# Altium schematic sheet Microcontroleur.SchDoc
size 408 x 276 mm; SheetNumber: 2; SheetTotal: 3
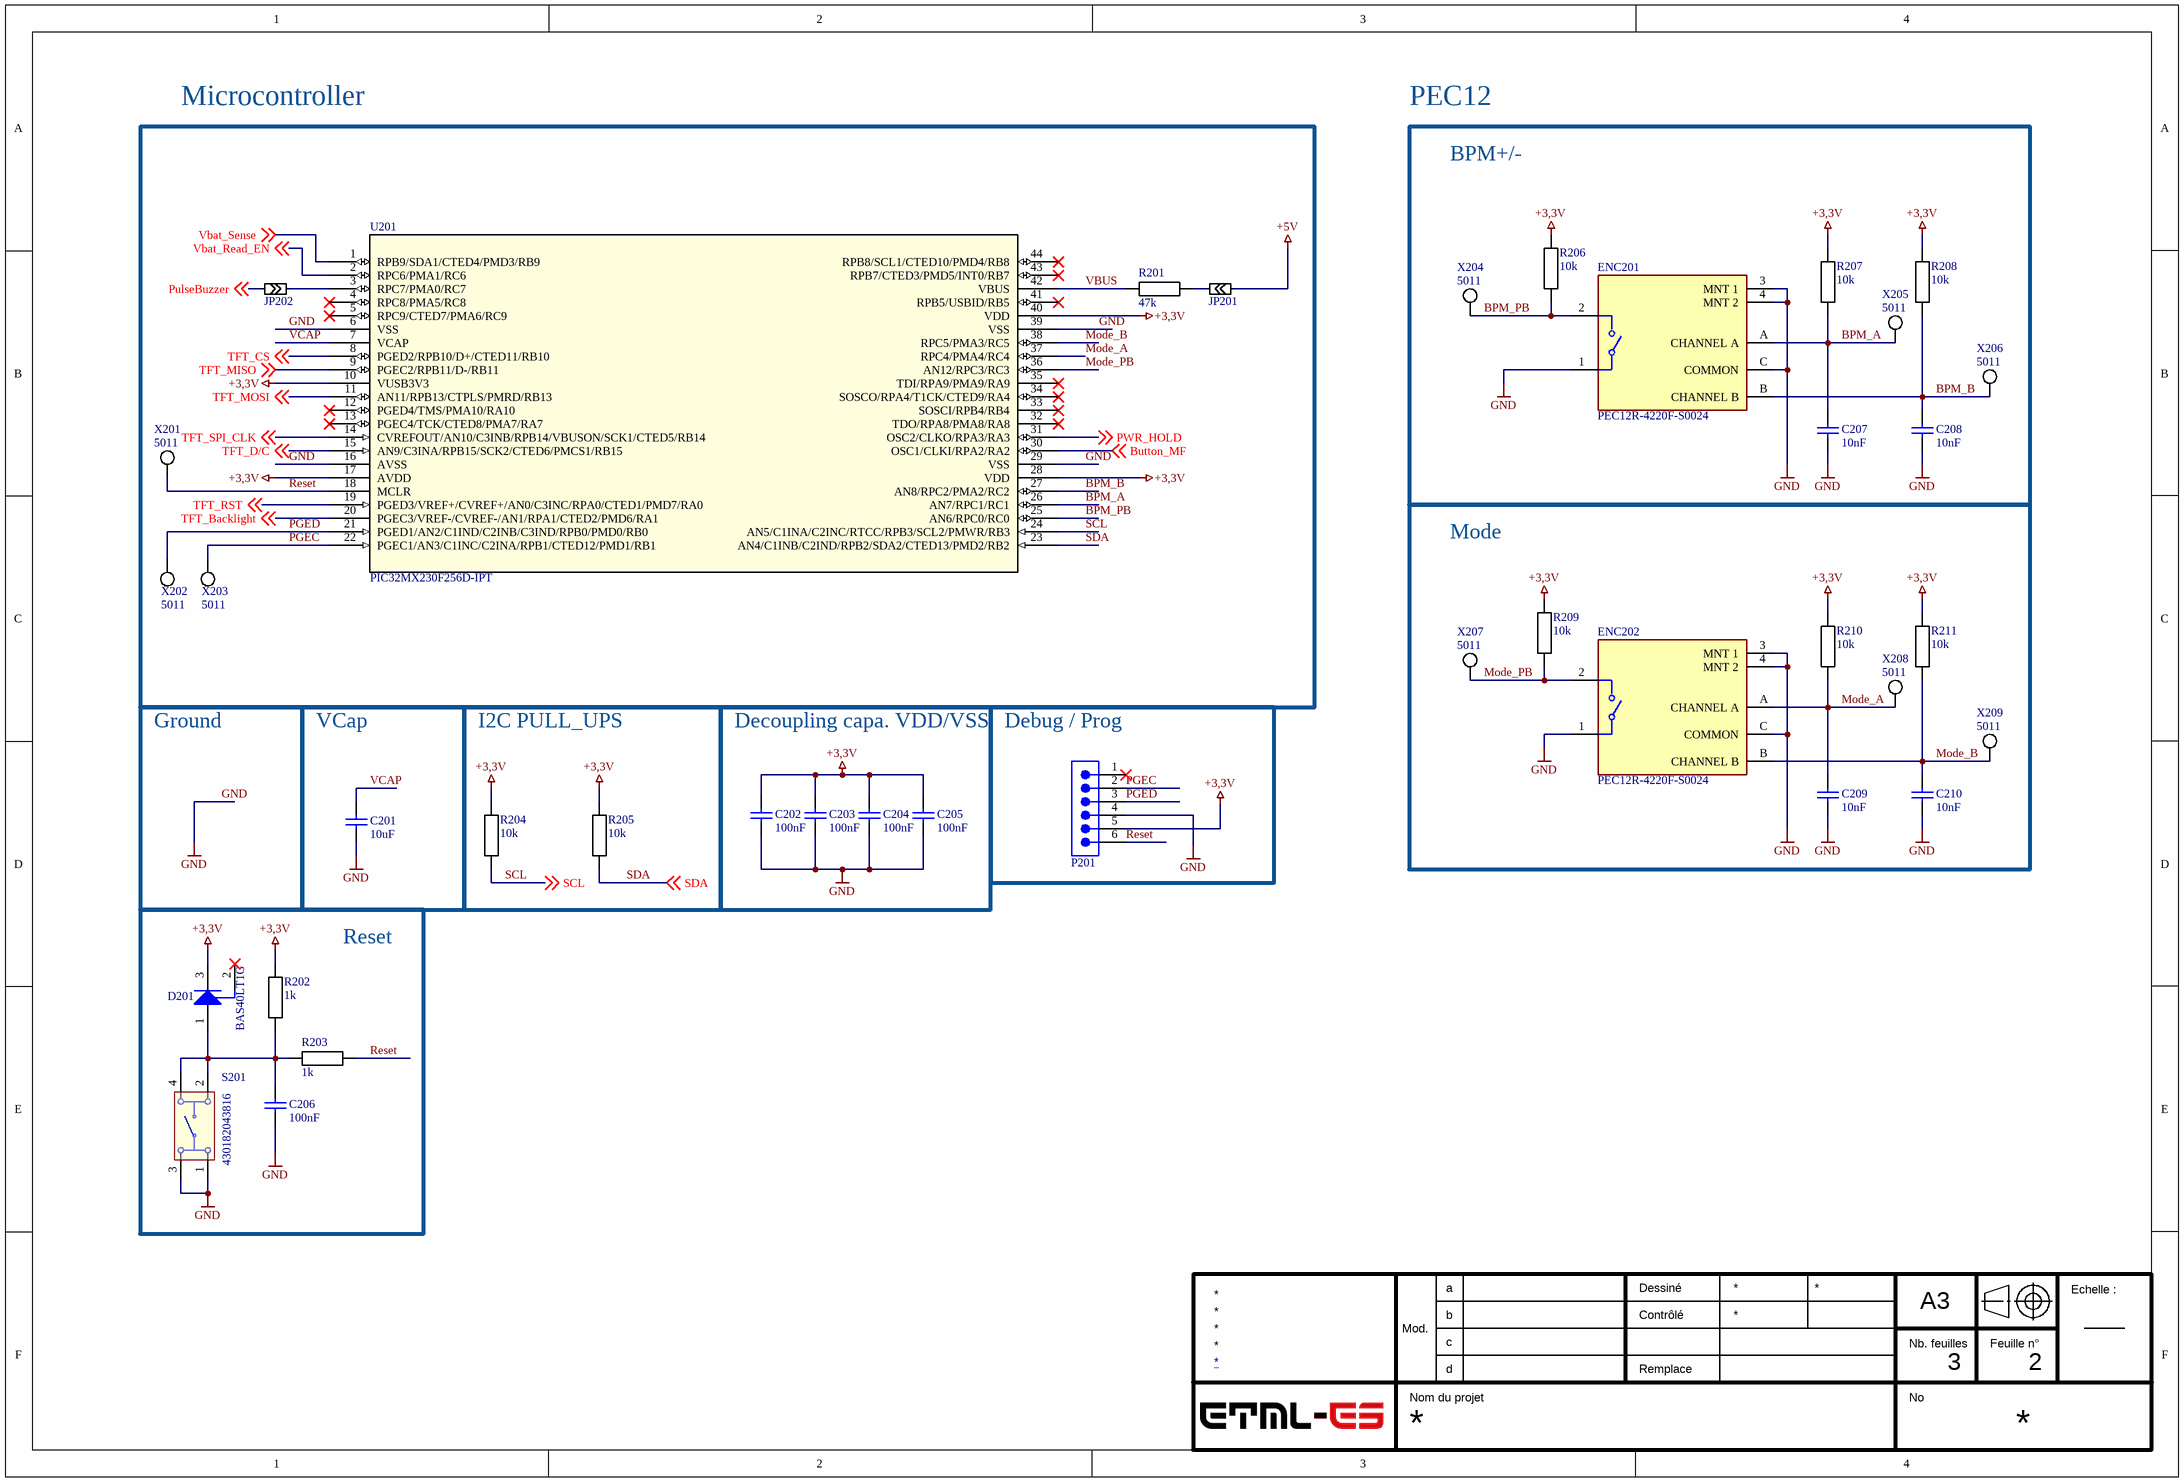
[diagram p0: Microcontroleur.SchDoc]

## Parts
C201  value 10uF  [CAPC2012X08M]  (hidden comment: Cap)
C202  value 100nF  [CAPC2012X08M]  (hidden comment: Cap)
C203  value 100nF  [CAPC2012X08M]  (hidden comment: Cap)
C204  value 100nF  [CAPC2012X08M]  (hidden comment: Cap)
C205  value 100nF  [CAPC2012X08M]  (hidden comment: Cap)
C206  value 100nF  [CAPC2012X08M]  (hidden comment: Cap)
C207  value 10nF  [CAPC2012X08M]  (hidden comment: Cap)
C208  value 10nF  [CAPC2012X08M]  (hidden comment: Cap)
C209  value 10nF  [CAPC2012X08M]  (hidden comment: Cap)
C210  value 10nF  [CAPC2012X08M]  (hidden comment: Cap)
D201  BAS40LT1G  [ONSC-SOT-23-3-318-08_V]
ENC201  PEC12R-4220F-S0024  [FP-PEC12R-4220F-S0024-MFG]
ENC202  PEC12R-4220F-S0024  [FP-PEC12R-4220F-S0024-MFG]
JP201  Jumper Pad  [Jumper SMD]  (value not drawn)
JP202  Jumper Pad  [Jumper SMD]  (value not drawn)
P201  61300611121  [61300611121]  (value not drawn)
R201  47k  [RESC2012X06M]
R202  1k  [RESC2012X06M]
R203  1k  [RESC2012X06M]
R204  10k  [RESC2012X06M]
R205  10k  [RESC2012X06M]
R206  10k  [RESC2012X06M]
R207  10k  [RESC2012X06M]
R208  10k  [RESC2012X06M]
R209  10k  [RESC2012X06M]
R210  10k  [RESC2012X06M]
R211  10k  [RESC2012X06M]
S201  430182043816  [430182043816]
U201  PIC32MX230F256D-IPT  [TQFP44_PT_MCH]
X201  5011  [Keystone_5011]
X202  5011  [Keystone_5011]
X203  5011  [Keystone_5011]
X204  5011  [Keystone_5011]
X205  5011  [Keystone_5011]
X206  5011  [Keystone_5011]
X207  5011  [Keystone_5011]
X208  5011  [Keystone_5011]
X209  5011  [Keystone_5011]

## Blocks framed on the sheet
Microcontroller: JP201 JP202 R201 U201 X201-X203
PEC12: C207-C210 ENC201 ENC202 R206-R211 X204-X209
VCap: C201
I2C PULL_UPS: R204 R205
Decoupling capa. VDD/VSS: C202-C205
Debug / Prog: P201
Reset: C206 D201 R202 R203 S201

## Nets
+3,3V: C202.2 C203.2 C204.2 C205.2 D201.3(K) P201.5 R202.2 R204.2 R205.2 R206.1 R207.2 R208.2 R209.1 R210.2 R211.2 U201.10(VUSB3V3) U201.17(AVDD) U201.28(VDD) U201.40(VDD)
+5V: JP201.2
GND: C201.1 C202.1 C203.1 C204.1 C205.1 C206.1 C207.1 C208.1 C209.1 C210.1 ENC201.1 ENC201.3(MNT_1) ENC201.4(MNT_2) ENC201.C(COMMON) ENC202.1 ENC202.3(MNT_1) ENC202.4(MNT_2) ENC202.C(COMMON) P201.4 S201.1 S201.3 U201.6(VSS) U201.16(AVSS) U201.29(VSS) U201.39(VSS)
BPM_A: C207.2 ENC201.A(CHANNEL_A) R207.1 U201.26(AN7/RPC1/RC1) X205.1(TP)
BPM_B: C208.2 ENC201.B(CHANNEL_B) R208.1 U201.27(AN8/RPC2/PMA2/RC2) X206.1(TP)
BPM_PB: ENC201.2 R206.2 U201.25(AN6/RPC0/RC0) X204.1(TP)
Button_MF: U201.30(OSC1/CLKI/RPA2/RA2) ; off-sheet Button_MF
Mode_A: C209.2 ENC202.A(CHANNEL_A) R210.1 U201.37(RPC4/PMA4/RC4) X208.1(TP)
Mode_B: C210.2 ENC202.B(CHANNEL_B) R211.1 U201.38(RPC5/PMA3/RC5) X209.1(TP)
Mode_PB: ENC202.2 R209.2 U201.36(AN12/RPC3/RC3) X207.1(TP)
PGEC: P201.2 U201.22(PGEC1/AN3/C1INC/C2INA/RPB1/CTED12/PMD1/RB1) X203.1(TP)
PGED: P201.3 U201.21(PGED1/AN2/C1IND/C2INB/C3IND/RPB0/PMD0/RB0) X202.1(TP)
PulseBuzzer: JP202.2 ; off-sheet PulseBuzzer
PWR_HOLD: U201.31(OSC2/CLKO/RPA3/RA3) ; off-sheet PWR_HOLD
Reset: P201.6 R203.1 U201.18(MCLR) X201.1(TP)
SCL: R204.1 U201.24(AN5/C1INA/C2INC/RTCC/RPB3/SCL2/PMWR/RB3) ; off-sheet SCL
SDA: R205.1 U201.23(AN4/C1INB/C2IND/RPB2/SDA2/CTED13/PMD2/RB2) ; off-sheet SDA
TFT_Backlight: U201.20(PGEC3/VREF-/CVREF-/AN1/RPA1/CTED2/PMD6/RA1) ; off-sheet TFT_Backlight
TFT_CS: U201.8(PGED2/RPB10/D+/CTED11/RB10) ; off-sheet TFT_CS
TFT_D/C: U201.15(AN9/C3INA/RPB15/SCK2/CTED6/PMCS1/RB15) ; off-sheet TFT_D/C
TFT_MISO: U201.9(PGEC2/RPB11/D-/RB11) ; off-sheet TFT_MISO
TFT_MOSI: U201.11(AN11/RPB13/CTPLS/PMRD/RB13) ; off-sheet TFT_MOSI
TFT_RST: U201.19(PGED3/VREF+/CVREF+/AN0/C3INC/RPA0/CTED1/PMD7/RA0) ; off-sheet TFT_RST
TFT_SPI_CLK: U201.14(CVREFOUT/AN10/C3INB/RPB14/VBUSON/SCK1/CTED5/RB14) ; off-sheet TFT_SPI_CLK
Vbat_Read_EN: U201.2(RPC6/PMA1/RC6) ; off-sheet Vbat_Read_EN
Vbat_Sense: U201.1(RPB9/SDA1/CTED4/PMD3/RB9) ; off-sheet Vbat_Sense
VBUS: R201.1 U201.42(VBUS)
VCAP: C201.2 U201.7(VCAP)
NetC206_2: C206.2 D201.1(A) R202.1 R203.2 S201.2 S201.4
NetJP201_1: JP201.1 R201.2
NetJP202_1: JP202.1 U201.3(RPC7/PMA0/RC7)

Not connected (* = marked no-connect by the designer): D201 2(NC)*; P201 1*; U201 4(RPC8/PMA5/RC8)* 5(RPC9/CTED7/PMA6/RC9)* 12(PGED4/TMS/PMA10/RA10)* 13(PGEC4/TCK/CTED8/PMA7/RA7)* 32(TDO/RPA8/PMA8/RA8)* 33(SOSCI/RPB4/RB4)* 34(SOSCO/RPA4/T1CK/CTED9/RA4)* 35(TDI/RPA9/PMA9/RA9)* 41(RPB5/USBID/RB5)* 43(RPB7/CTED3/PMD5/INT0/RB7)* 44(RPB8/SCL1/CTED10/PMD4/RB8)*

## Notes on the sheet
- BPM+/-
- Mode
- Ground
- a
- Dessiné
- A3
- Echelle :
- Mod.
- b
- c
- d
- Contrôlé
- Remplace
- Nb. feuilles
- Feuille n°
- Nom du projet
- No

## Library data of the parts
C201-C210 = Cap: Capacitor; Published: 8-Jun-2000; LatestRevisionDate: 17-Jul-2002; LatestRevisionNote: Re-released for DXP Platform.; PackageReference: RAD-0.3; Publisher: Altium Limited; PackageDescription: Radial Cap, Thru-Hole; 2 Leads; 0.3 in Pin Spacing
D201 = CMP-1055-00540-1: Schottky Barrier Diode, 3-Pin SOT-23, Pb-Free, Tape and Reel; Manufacturer: On Semiconductor; Configuration: Single; ComponentLink3Description: Package Specification; ComponentLink1URL: http://www.onsemi.com/; ComponentLink2Description: Datasheet; PackageDescription: 3-Pin Small Outline Transistor, Body 2.92 x 1.3 mm, Pitch 0.95 mm; ComponentLink3URL: http://www.onsemi.cn/pub_link/Collateral/318-08.PDF; PartNumber: BAS40LT1G; DatasheetVersion: Rev. 10; Packing: Tape and Reel; PackageReference: SOT-23-3-318-08; ComponentLink1Description: Manufacturer URL; ComponentLink2URL: http://www.onsemi.cn/pub_link/Collateral/BAS40LT1-D.PDF; RoHS: TRUE; Mounting Technology: Surface Mount; PackageVersion: Rev. AP, 11/2009
ENC201 ENC202 = CMP-07421-000021-1: ROTARY ENCODER MECHANICAL 24PPR; Built in Switch: Yes; Pulses per Revolution: 24; Output Type: Quadrature; Hole Diameter: 2mm; Number of Channels: 2; Max Supply Voltage (DC): 5V; RoHS Compliant: Yes; Max Operating Temperature: 70°C; Length: 26mm; Width: 12.5mm; Encoder Type: Mechanical; Series: PEC12R; Mount: Through Hole; Height: 13.4mm; Packaging: Bulk; Package Quantity: 150; Termination: PC Pin; Min Operating Temperature: -30°C; REACH SVHC: No SVHC; Detent: Yes; Orientation: Vertical
JP201 JP202 = Jumper Pad: SMD Jumper
P201 = 61300611121: WR-PHD Pin Header, THT, Vertical, pitch 2.54mm, 1 Row, 6P; Manufacturer: Wurth Elektronik; Contact Resistance: 20mOhm; Rated Current: 3A; Working Voltage: 250V; Withstanding Voltage: 500V; Manufacturer Part Number: 61300611121; Category: Board-to-Board Connectors; Match Code: WR-PHD; ComponentLink1Description: Website Link; ComponentLink1URL: https://www.we-online.com/redexpert/article/61300611121?ad; ComponentLink2Description: Datasheet Link; ComponentLink2URL: https://www.we-online.com/redexpert/spec/61300611121?ad; Mount: Through Hole; Operating Temperature Max: 105°C; Operating Temperature Min: -40°C; Packaging: Bag; Gender: Pin Header; Number of Pins: 6; Number of Rows: 1; Orientation: Vertical; Pitch: 2.54mm
R201 = CMP-066-000207-2: RES 47kohm  ±1% 0.125W 2012 (0805 INCH); Manufacturer Number: RC0805FR-0747KL; Manufacturer: Yageo; TemperatureRange: -55°C to 155°C; Voltage: 150V; IsStocked: 1; TemperatureCoeff: ±200ppm/°C; PN: PN-427242; Category: Passives; Supplier Price 1: 0.0200; Power: 0.125W; Supplier 1: ETML; Tolerance: ±1%; SubCategory: Resistances couche epaisse; Supplier Part Number 1: FAB.0805_R 47k; Value: 47k
R202 R203 = CMP-066-000187-2: RES 1.0kohm  ±1% 0.125W 2012 (0805 INCH); Manufacturer: Yageo; Manufacturer Number: RC0805FR-071KL; PN: PN-746409; TemperatureRange: -55°C to 155°C; IsStocked: 1; TemperatureCoeff: ±200ppm/°C; Voltage: 150V; Supplier 1: ETML; Value: 1k; SubCategory: Resistances couche epaisse; Supplier Price 1: 0.0200; Supplier Part Number 1: FAB.0805_R 1k0; Category: Passives; Tolerance: ±1%; Power: 0.125W
R204 R205 = CMP-066-000199-2: RES 10kohm  ±1% 0.125W 2012 (0805 INCH); Manufacturer Number: RC0805FR-0710KL; Manufacturer: Yageo; PN: PN-374909; TemperatureCoeff: ±200ppm/°C; Voltage: 150V; TemperatureRange: -55°C to 155°C; IsStocked: 1; Tolerance: ±1%; Category: Passives; Value: 10k; Supplier Price 1: 0.0200; Supplier Part Number 1: FAB.0805_R 10k; Supplier 1: ETML; SubCategory: Resistances couche epaisse; Power: 0.125W
R206-R211 = R: Resistor 0805 M; Supplier 1: ETML; Supplier 1 Price: 0.00
S201 = CMP-1452-00013-1: WS-TASV SMD Tact Switch 6X6 mm; Manufacturer: Wuerth Elektronik; NoPins: 04; ComponentLink2Description: Datasheet; PackageReference: 430182043816; ComponentLink2URL: http://katalog.we-online.de/em/datasheet/4301x2.pdf; ComponentLink1URL: http://www.we-online.com; PartNumber: 430182043816; ComponentLink1Description: Manufacturer URL
U201 = PIC32MX230F256D-IPT: No Description Available; Mfr_Name: Microchip; RefDes: RefDes; Type: Type
X201-X209 = CMP-054-000005-1: TEST THT MULTIPURPOSE BK; Manufacturer: Keystone; IsStocked: True; PN: PN-926990; Supplier 1: ETML; Value: 5011; Manufacturer Number: 5011; Supplier Part Number 1: MAG.428.014; Category: Connectors; SubCategory: Testpoints; Supplier Price 1: 0.2439